# Altium schematic sheet MCU_2.SchDoc
size A
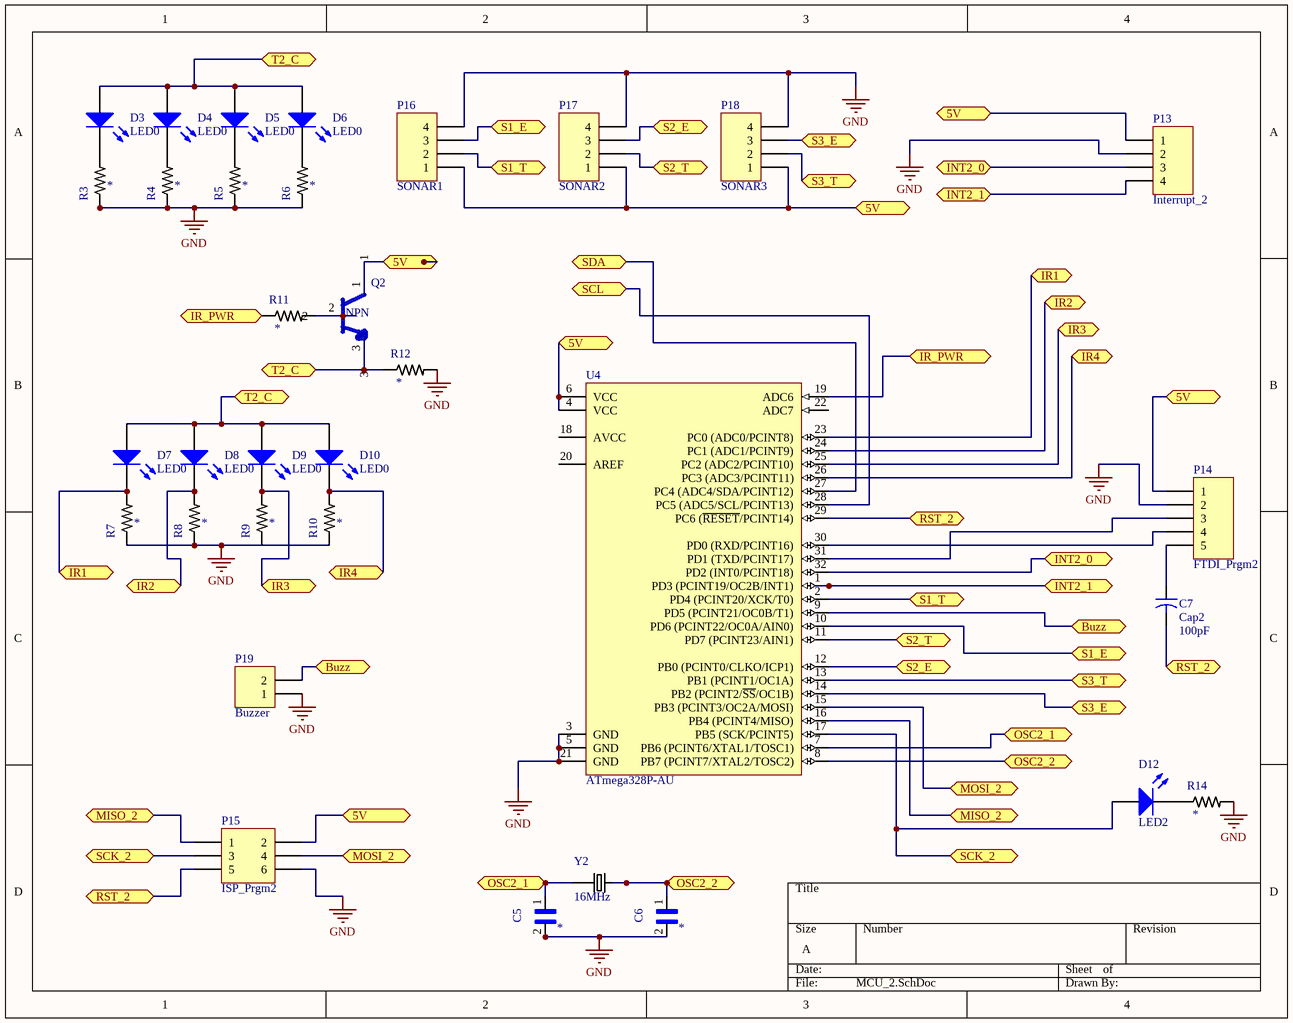
[diagram p0: MCU_2.SchDoc]

## Parts
C5  Cap_0805  [CAP_0805]  (value not drawn)
C6  Cap_0805  [CAP_0805]  (value not drawn)
C7  Cap2  value 100pF  [CAPR5-4X5]
D3  LED0  [LED-1]
D4  LED0  [LED-1]
D5  LED0  [LED-1]
D6  LED0  [LED-1]
D7  LED0  [LED-1]
D8  LED0  [LED-1]
D9  LED0  [LED-1]
D10  LED0  [LED-1]
D12  LED2  [3.2X1.6X1.1]
P13  Interrupt_2  [HDR1X4]
P14  FTDI_Prgm2  [HDR1X5]
P15  ISP_Prgm2  [HDR2X3]
P16  SONAR1  [HDR1X4]
P17  SONAR2  [HDR1X4]
P18  SONAR3  [HDR1X4]
P19  Buzzer  [HDR1X2]
Q2  NPN  [NPN-d400]
R3  Res_0805  [Res_0805]  (value not drawn)
R4  Res_0805  [Res_0805]  (value not drawn)
R5  Res_0805  [Res_0805]  (value not drawn)
R6  Res_0805  [Res_0805]  (value not drawn)
R7  Res_0805  [Res_0805]  (value not drawn)
R8  Res_0805  [Res_0805]  (value not drawn)
R9  Res_0805  [Res_0805]  (value not drawn)
R10  Res_0805  [Res_0805]  (value not drawn)
R11  Res_0805  [Res_0805]  (value not drawn)
R12  Res_0805  [Res_0805]  (value not drawn)
R14  Res_0805  [Res_0805]  (value not drawn)
U4  ATmega328P-AU  [32A_N]
Y2  16MHz  [XTAL_THT]

## Ports
5V, Buzz, INT2_0, INT2_1, IR1, IR2, IR3, IR4, IR_PWR, MISO_2, MOSI_2, OSC2_1, OSC2_2, RST_2, S1_E, S1_T, S2_E, S2_T, S3_E, S3_T, SCK_2, SCL, SDA, T2_C

## Nets
GND: C5.2 C6.2 P13.2 P14.2 P15.6 P16.4 P17.4 P18.4 P19.1 R3.1 R4.1 R5.1 R6.1 R7.1 R8.1 R9.1 R10.1 R12.2 R14.2 U4.3(GND) U4.5(GND) U4.21(GND)
5V: P13.1 P14.1 P15.2 P16.1 P17.1 P18.1 Q2.1 U4.4(VCC) U4.6(VCC) ; port 5V
Buzz: P19.2 U4.9(PD5_(PCINT21/OC0B/T1)) ; port Buzz
INT2_0: P13.3 U4.32(PD2_(INT0/PCINT18)) ; port INT2_0
INT2_1: P13.4 U4.1(PD3_(PCINT19/OC2B/INT1)) ; port INT2_1
IR1: D7.2(K) R7.2 U4.23(PC0_(ADC0/PCINT8)) ; port IR1
IR2: D8.2(K) R8.2 U4.24(PC1_(ADC1/PCINT9)) ; port IR2
IR3: D9.2(K) R9.2 U4.25(PC2_(ADC2/PCINT10)) ; port IR3
IR4: D10.2(K) R10.2 U4.26(PC3_(ADC3/PCINT11)) ; port IR4
IR_PWR: R11.1 U4.19(ADC6) ; port IR_PWR
MISO_2: P15.1 U4.16(PB4_(PCINT4/MISO)) ; port MISO_2
MOSI_2: P15.4 U4.15(PB3_(PCINT3/OC2A/MOSI)) ; port MOSI_2
OSC2_1: C5.1 U4.7(PB6_(PCINT6/XTAL1/TOSC1)) Y2.1 ; port OSC2_1
OSC2_2: C6.1 U4.8(PB7_(PCINT7/XTAL2/TOSC2)) Y2.2 ; port OSC2_2
RST_2: C7.2 P15.5 U4.29(PC6_(~{RESET}/PCINT14)) ; port RST_2
S1_E: P16.3 U4.10(PD6_(PCINT22/OC0A/AIN0)) ; port S1_E
S1_T: P16.2 U4.2(PD4_(PCINT20/XCK/T0)) ; port S1_T
S2_E: P17.3 U4.12(PB0_(PCINT0/CLKO/ICP1)) ; port S2_E
S2_T: P17.2 U4.11(PD7_(PCINT23/AIN1)) ; port S2_T
S3_E: P18.3 U4.14(PB2_(PCINT2/~{SS}/OC1B)) ; port S3_E
S3_T: P18.2 U4.13(PB1_(PCINT1/OC1A)) ; port S3_T
SCK_2: D12.1(A) P15.3 U4.17(PB5_(SCK/PCINT5)) ; port SCK_2
SCL: U4.28(PC5_(ADC5/SCL/PCINT13)) ; port SCL
SDA: U4.27(PC4_(ADC4/SDA/PCINT12)) ; port SDA
T2_C: D3.1(A) D4.1(A) D5.1(A) D6.1(A) D7.1(A) D8.1(A) D9.1(A) D10.1(A) Q2.3 R12.1 ; port T2_C
NetC7_1: C7.1 P14.5
NetD3_2: D3.2(K) R3.2
NetD4_2: D4.2(K) R4.2
NetD5_2: D5.2(K) R5.2
NetD6_2: D6.2(K) R6.2
NetD12_2: D12.2(K) R14.1
NetP14_3: P14.3 U4.31(PD1_(TXD/PCINT17))
NetP14_4: P14.4 U4.30(PD0_(RXD/PCINT16))
NetQ2_2: Q2.2 R11.2

Not connected (* = marked no-connect by the designer): U4 18(AVCC) 20(AREF) 22(ADC7)

## Library data of the parts
C5 C6 = Cap_0805: Cap Ceramic 10uF 10V X5R 10% SMD 0805 85Â°C Embossed Plastic T/R; MF: Samsung Electro-Mechanics; MP: CL21A106KPFNNWE; Price: None; SnapEDA_Link: https://www.snapeda.com/parts/CL21A106KPFNNWE/Samsung%20Electro-Mechanics/view-part/?ref=snap; Package: 0805 Samsung; Availability: Unavailable; Value: *
C7 = Cap2: Capacitor; Published: 23-Sep-2002; PackageReference: CAPR5-4X5; Publisher: Altium Limited; PackageDescription: Capacitor; 2 Leads
D3-D10 = LED0: Typical INFRARED GaAs LED; Published: 8-Jun-2000; LatestRevisionDate: 08-Jul-2005; LatestRevisionNote: Mech Layer 1 removed.; PackageReference: LED-0; Publisher: Altium Limited; PackageDescription: LED; 2 Leads
D12 = LED2: Typical RED, GREEN, YELLOW, AMBER GaAs LED; Published: 8-Jun-2000; LatestRevisionDate: 17-Jul-2002; LatestRevisionNote: Re-released for DXP Platform.; PackageVersion: Feb-2002; PackageReference: 3.2X1.6X1.1; Publisher: Altium Limited; PackageDescription: SM LED; 2 Flat Leads
P13 P16-P18 = Header 4: Header, 4-Pin; LatestRevisionDate: 17-Jul-2002; LatestRevisionNote: Re-released for DXP Platform.; Publisher: Altium Limited
P14 = Header 5: Header, 5-Pin; LatestRevisionDate: 17-Jul-2002; LatestRevisionNote: Re-released for DXP Platform.; Publisher: Altium Limited
P15 = Header 3X2: Header, 3-Pin, Dual row; LatestRevisionDate: 17-Jul-2002; LatestRevisionNote: Re-released for DXP Platform.; Publisher: Altium Limited
P19 = Header 2: Header, 2-Pin; LatestRevisionDate: 17-Jul-2002; LatestRevisionNote: Re-released for DXP Platform.; Publisher: Altium Limited
Q2 = Component_1: NPN- d400
R3-R12 R14 = Res_0805: Res Thick Film 0805 392 Ohm 1% 1/3W Â±100ppm/Â°C Molded SMD SMD T/R; MP: CRGH0805F392R; MF: TE Connectivity; TE_purchase_URL: https://www.te.com/usa-en/product-5-1879509-5.html?te_bu=Cor&te_type=disp&te_campaign=seda_glo_cor-seda-global-disp-prtnr-fy19-seda-model-bom-cta_sma-317_1&elqCampaignId=32493; Availability: Unavailable; SnapEDA_Link: https://www.snapeda.com/parts/CRGH0805F392R/TE%20Connectivity%20Passive%20Product/view-part/?ref=snap; Price: None; Package: 0805 TE Connectivity; Value: *
U4 = ATmega328P-AU: 8-bit AVR Microcontroller, 32KB Flash, 1KB EEPROM, 2KB SRAM, 32-pin TQFP, Industrial Grade (-40°C to 85°C); Published: 1-Apr-2010; DatasheetVersion: revA, Jan-2010; PackageVersion: revB, Oct-2001; PackageReference: 32A; Publisher: Altium Limited; PackageDescription: 32-Lead, 7x7x1.0 mm Body, 0.8mm Lead Pitch, Thin Profile Plastic Quad Flat Package (TQFP); Supplier 1: Digi-Key; Supplier Part Number 1: ATMEGA328P-AU-ND; Supplier 2: Farnell; Supplier Part Number 2: 1715486; Supplier 3: Mouser; Supplier Part Number 3: 556-ATMEGA328P-AU; Code_JEDEC: MS-026-ABA; ComponentLink1Description: Manufacturer Link; ComponentLink1URL: http://www.atmel.com/products/avr/default.asp?; ComponentLink2Description: ATmega48A/48PA/88A/88PA/168A/168PA/328/328P Datasheet; ComponentLink2URL: http://www.atmel.com/dyn/resources/prod_documents/8271.pdf; ComponentLink3Description: ATmega48A/48PA/88A/88PA/168A/168PA/328/328P Summary; ComponentLink3URL: http://www.atmel.com/dyn/resources/prod_documents/8271S.pdf; ComponentLink4Description: Atmel.com Home; ComponentLink4URL: http://www.atmel.com
Y2 = Xtal_THT: Crystal 3.93216MHz 17pF 2-Pin HC-49/U; MF: ECS Inc.; MP: ECS-39-17-1X; Availability: Unavailable; Price: None; SnapEDA_Link: https://www.snapeda.com/parts/ECS-39-17-1X/ECS%20Inc./view-part/?ref=snap; Package: HC49/U ECS International; Value: *